# EAGLE schematic bc-module-climate (EAGLE 7.7.0)
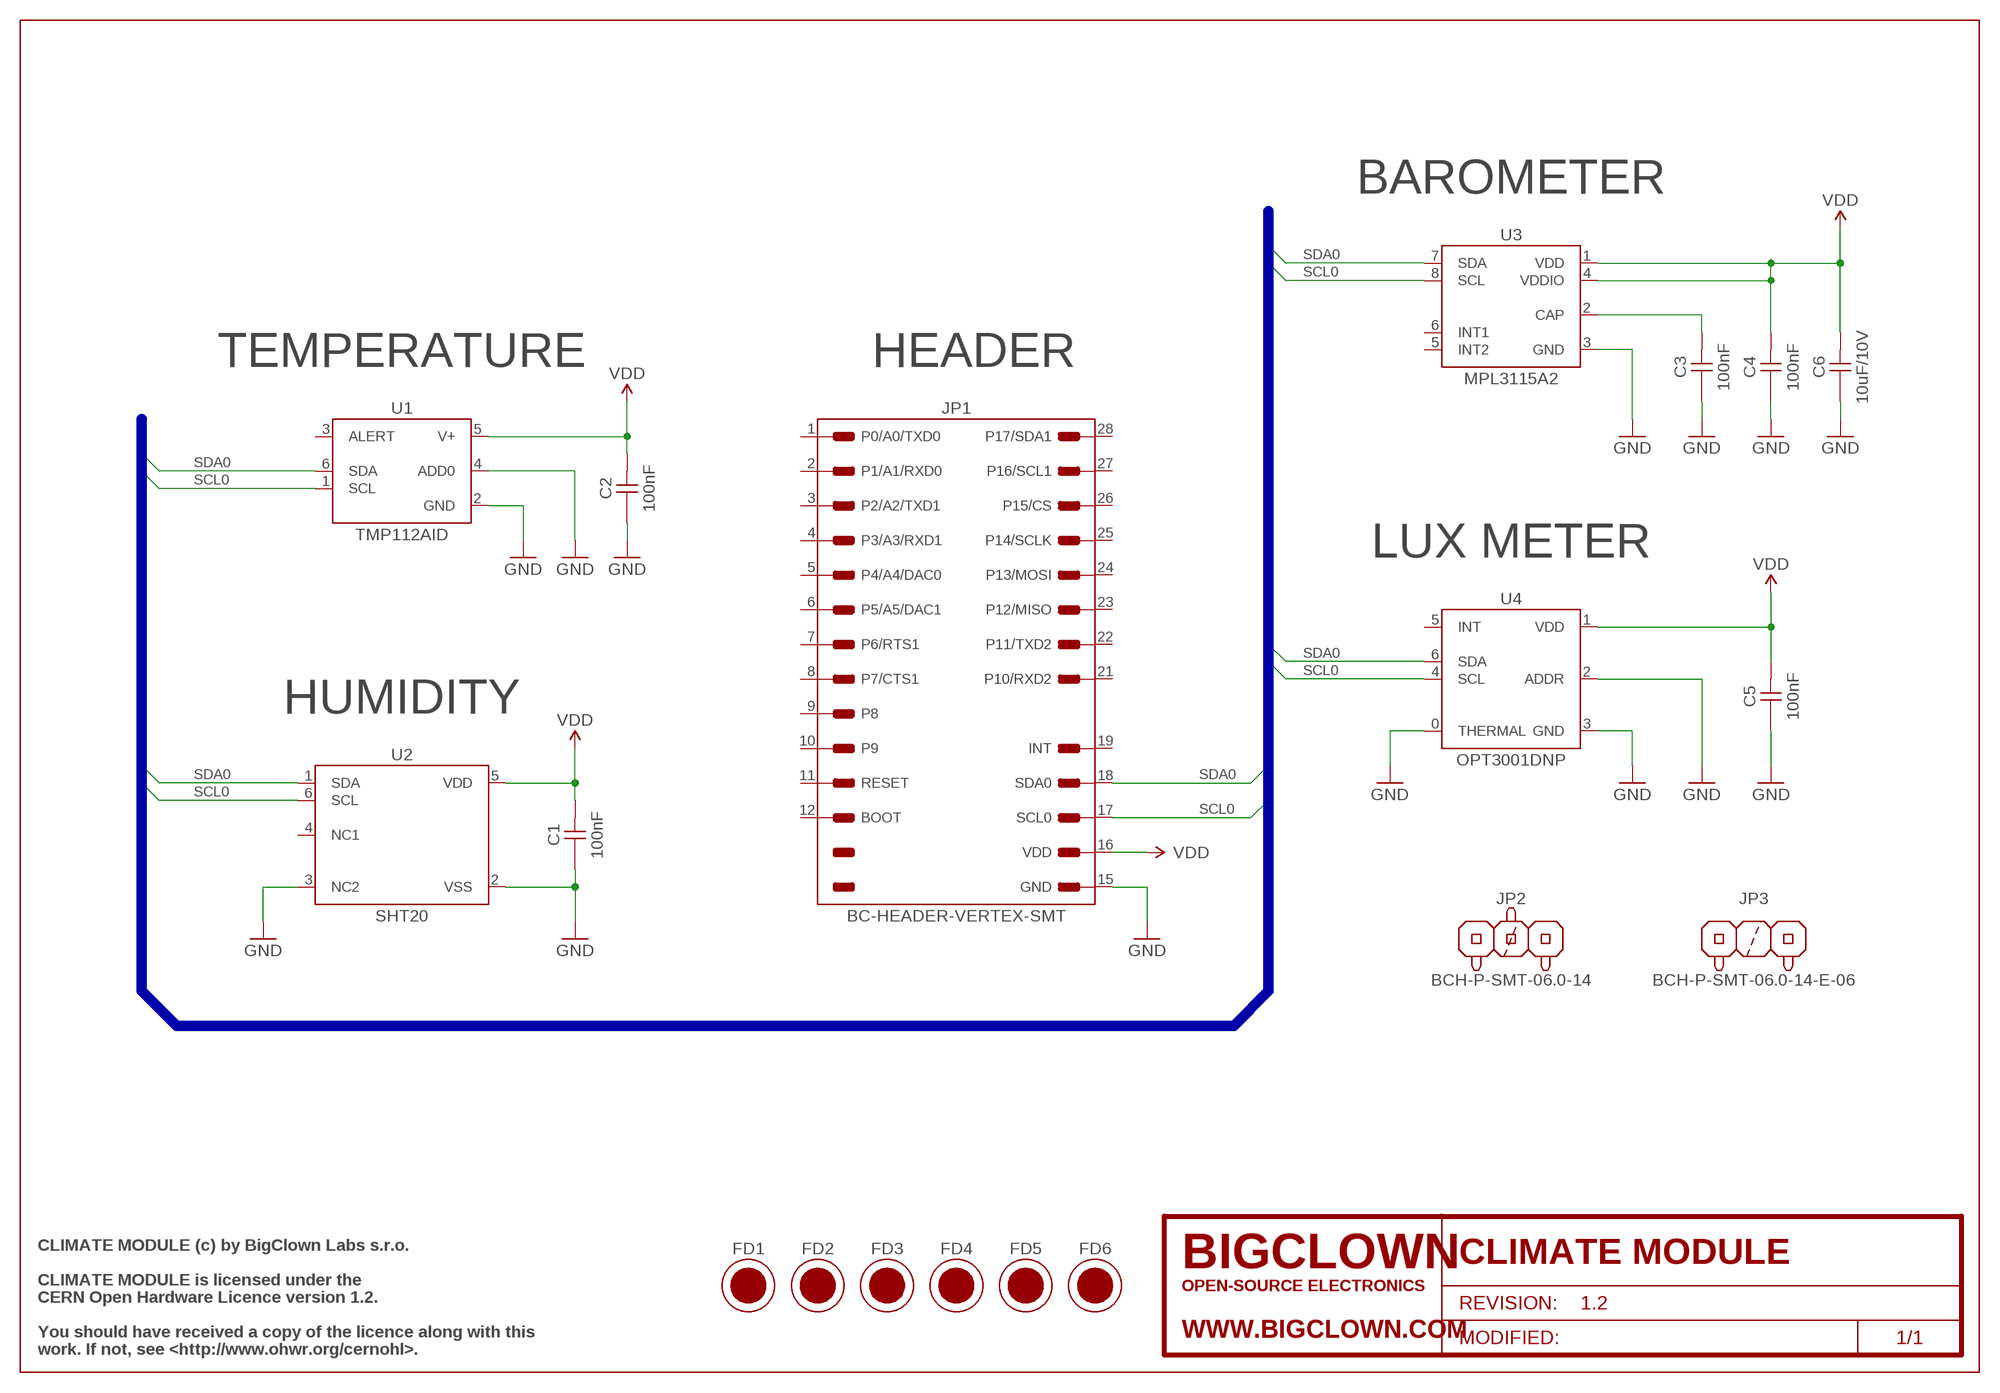
[diagram p0: schematic, sheet 1]

## Parts
C1  100nF  C-0603-100NF  [CAPACITOR-0603_R]
C2  100nF  C-0603-100NF  [CAPACITOR-0603_R]
C3  100nF  C-0603-100NF  [CAPACITOR-0603_R]
C4  100nF  C-0603-100NF  [CAPACITOR-0603_R]
C5  100nF  C-0603-100NF  [CAPACITOR-0603_R]
C6  10uF/10V  C-0603-10UF-10V  [CAPACITOR-0603_R]
FD1  FIDUCIAL  [FIDUCIAL-1MM]
FD2  FIDUCIAL  [FIDUCIAL-1MM]
FD3  FIDUCIAL  [FIDUCIAL-1MM]
FD4  FIDUCIAL  [FIDUCIAL-1MM]
FD5  FIDUCIAL  [FIDUCIAL-1MM]
FD6  FIDUCIAL  [FIDUCIAL-1MM]
FRAME1  FRAME-SCH/A4L-BRD/A4L  [FRAME-A4L]
JP1  BC-HEADER-VERTEX-SMT  [BC-HEADER-VERTEX-SMT]
JP2  BCH-P-SMT-06.0-14  JP-BCH-P-SMT-06.0-14  [BCH-P-SMT-14]
JP3  BCH-P-SMT-06.0-14-E-06  JP-BCH-P-SMT-06.0-14-E-06  [BCH-P-SMT-14-E-06]
U1  TMP112AID  U-TMP112AID  [TMP112AID_R]
U2  SHT20  U-SHT20  [SHT20_R]
U3  MPL3115A2  U-MPL3115A2  [MPL3115A2_R]
U4  OPT3001DNP  U-OPT3001DNP  [OPT3001DNP_R]

## Nets
CAP: C3.1 U3.2(CAP)
GND: C1.2 C2.2 C3.2 C4.2 C5.2 C6.2 JP1.15(GND) U1.2(GND) U1.4(ADD0) U2.2(VSS) U2.3(NC2) U3.3(GND) U4.0(THERMAL) U4.2(ADDR) U4.3(GND)
SCL0: JP1.17(SCL0) U1.1(SCL) U2.6(SCL) U3.8(SCL) U4.4(SCL)
SDA0: JP1.18(SDA0) U1.6(SDA) U2.1(SDA) U3.7(SDA) U4.6(SDA)
VDD: C1.1 C2.1 C4.1 C5.1 C6.1 JP1.16(VDD) U1.5(V+) U2.5(VDD) U3.1(VDD) U3.4(VDDIO) U4.1(VDD)
Unconnected: JP1.1(P0/A0/TXD0) JP1.2(P1/A1/RXD0) JP1.3(P2/A2/TXD1) JP1.4(P3/A3/RXD1) JP1.5(P4/A4/DAC0) JP1.6(P5/A5/DAC1) JP1.7(P6/RTS1) JP1.8(P7/CTS1) JP1.9(P8) JP1.10(P9) JP1.11(RESET) JP1.12(BOOT) JP1.19(INT) JP1.21(P10/RXD2) JP1.22(P11/TXD2) JP1.23(P12/MISO) JP1.24(P13/MOSI) JP1.25(P14/SCLK) JP1.26(P15/CS) JP1.27(P16/SCL1) JP1.28(P17/SDA1) U1.3(ALERT) U2.4(NC1) U3.5(INT2) U3.6(INT1) U4.5(INT)

## Buses
SDA0,SCL0

## Notes on the sheet
- BAROMETER
- TEMPERATURE | HEADER
- LUX METER
- HUMIDITY
- CLIMATE MODULE (c) by BigClown Labs s.r.o.
- CLIMATE MODULE is licensed under the
- CERN Open Hardware Licence version 1.2.
- You should have received a copy of the licence along with this
- work. If not, see <http://www.ohwr.org/cernohl>.

## Library data of the parts
C1-C5 = bc-capacitor:C-0603-100NF; BCPN: BC-C-0603-100NF
C6 = bc-capacitor:C-0603-10UF-10V; BCPN: BC-C-0603-10UF-10V
FD1-FD6 = bc-fiducial:FIDUCIAL; BCPN: -
FRAME1 = bc-frame:FRAME-SCH/A4L-BRD/A4L; BCPN: -; PROJECT_NAME: CLIMATE MODULE; PROJECT_REVISION: 1.2
JP1 = bc-header:BC-HEADER-VERTEX-SMT; BCPN: -
JP2 = bc-header:JP-BCH-P-SMT-06.0-14; BCPN: BC-JP-BCH-P-SMT-06.0-14
JP3 = bc-header:JP-BCH-P-SMT-06.0-14-E-06; BCPN: BC-JP-BCH-P-SMT-06.0-14-E-06
U1 = bc-sensor:U-TMP112AID; BCPN: BC-U-TMP112AID
U2 = bc-sensor:U-SHT20; BCPN: BC-U-SHT20
U3 = bc-sensor:U-MPL3115A2; BCPN: BC-U-MPL3115A2
U4 = bc-sensor:U-OPT3001DNP; BCPN: BC-U-OPT3001DNP